# EAGLE design Wand LED Board Rev1 (EAGLE 9.7.0)
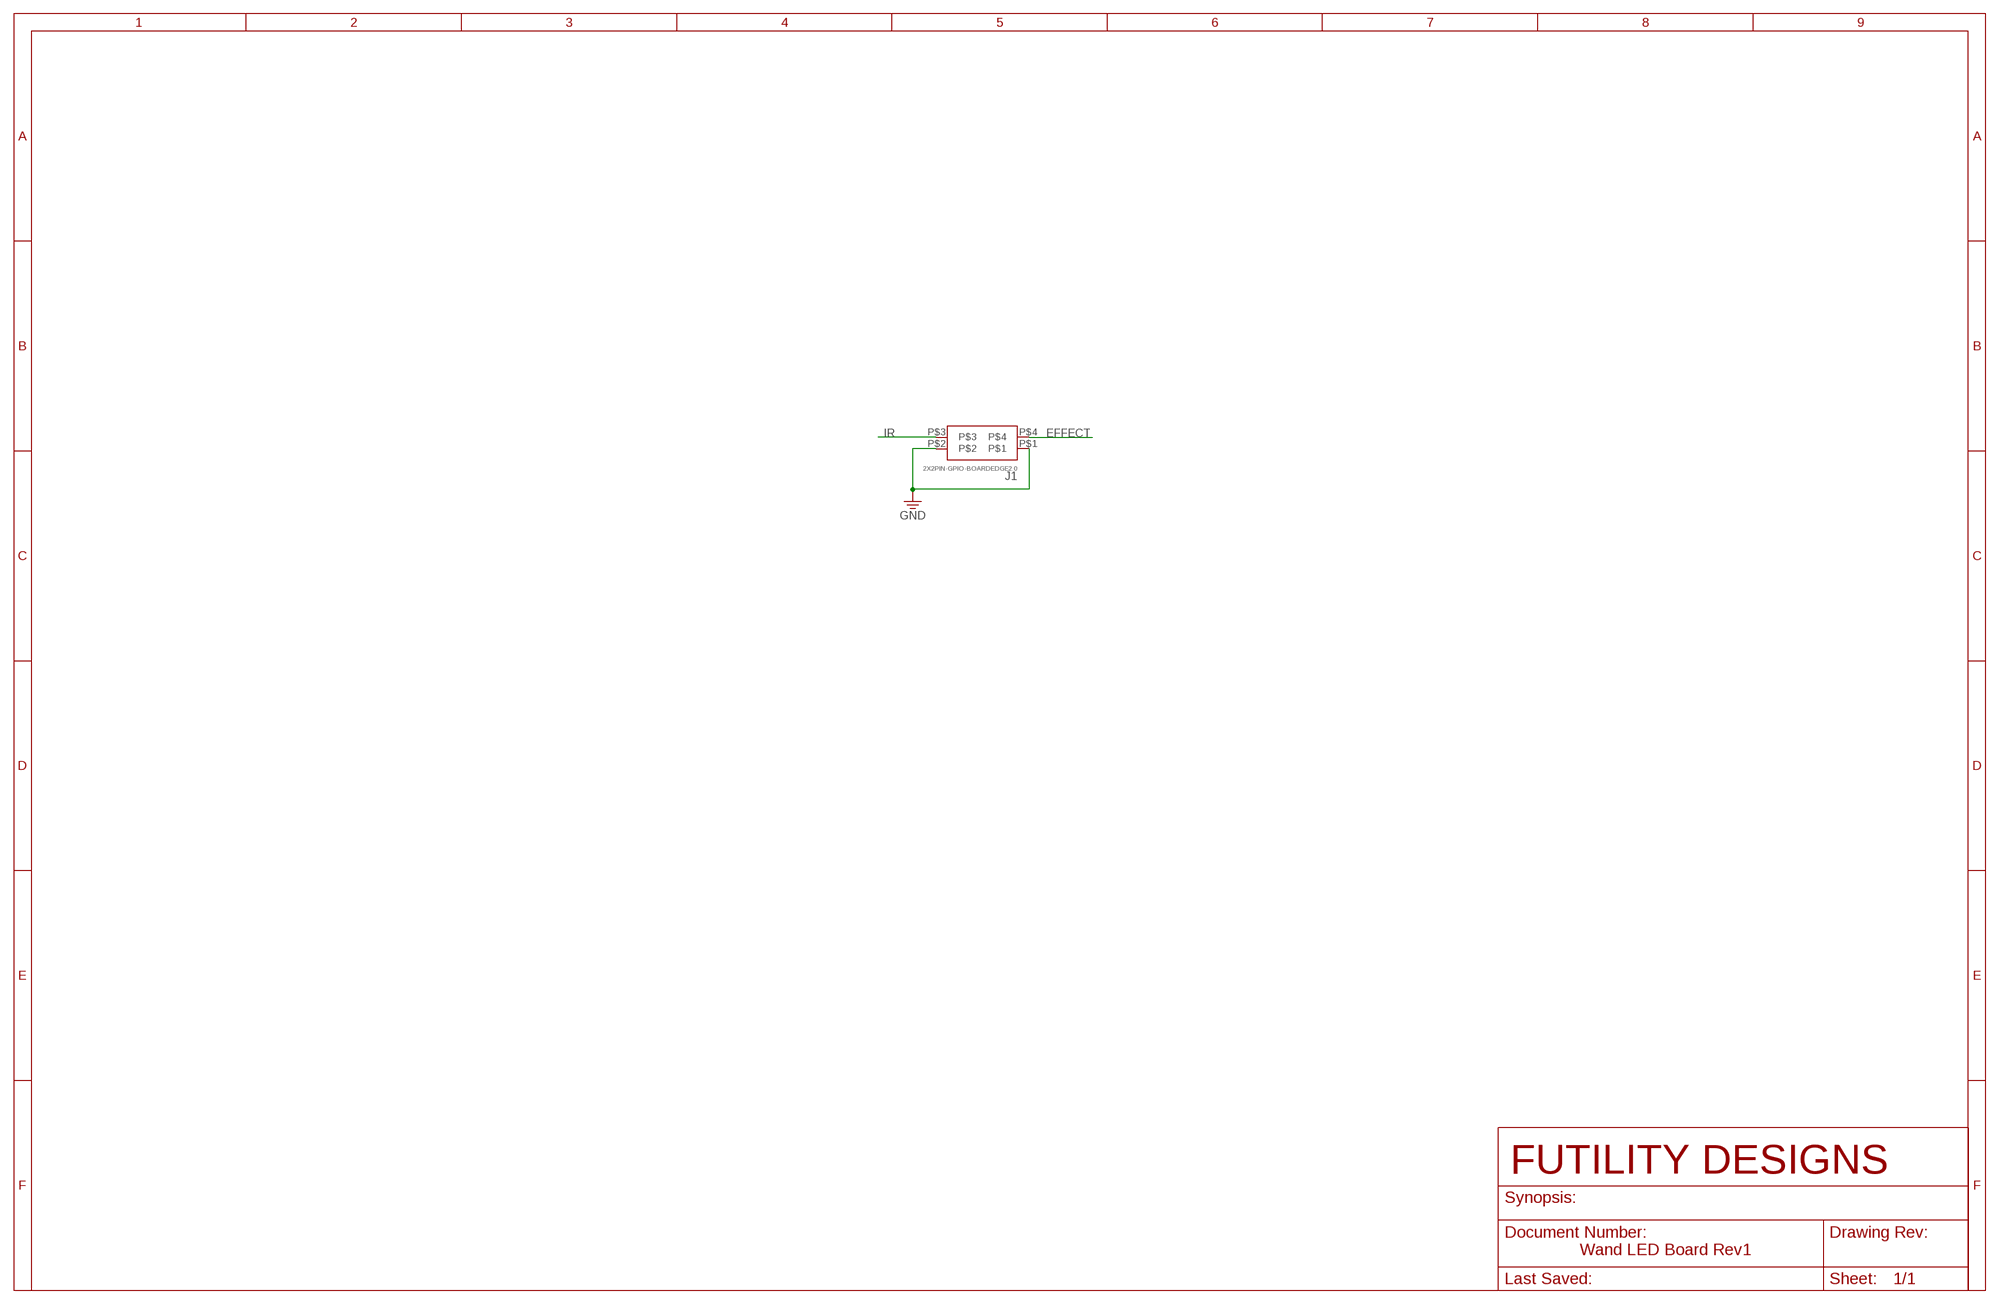
[diagram p0: schematic, sheet 1]

## Parts
J1  2X2PIN-GPIO-BOARDEDGE2.0  [2314820-4-BOARDEDGE]

## Nets
EFFECT: J1.P$4
GND: J1.P$1 J1.P$2
IR: J1.P$3

## Library data of the parts
J1 = 1-Chris-Connectors:2X2PIN-GPIO

## Board
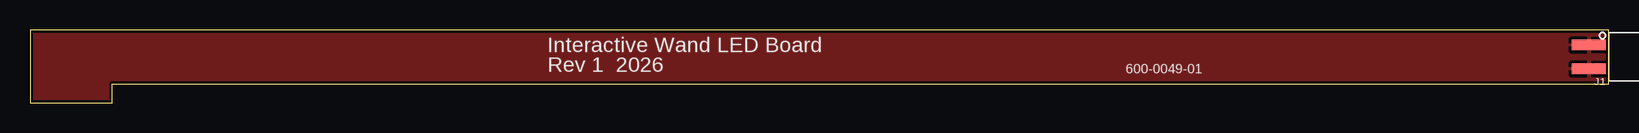
[diagram p1: board, top side]
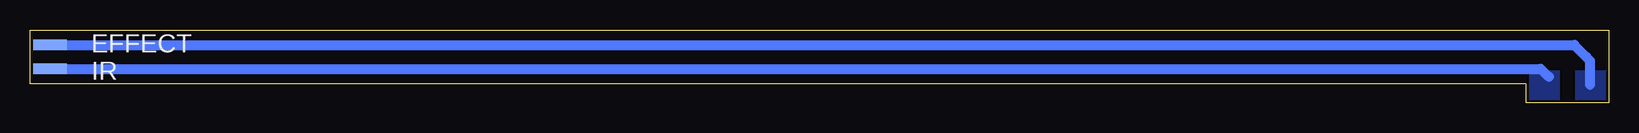
[diagram p2: board, bottom side, seen from below]

Size 131.55 x 6.12 mm. Coordinates in mm from the lower left corner, seen from the top.
Outline: 6.86,1.6 131.55,1.6 131.55,6.12 0,6.12 0,1.6 0,0 6.86,0 6.86,1.6
Copper layers (1*16): Top / Bottom
Stack-up Default Layer Stack: Top SilkScreen Epoxy Ink / Top SolderMask SR:Green 0.0254mm Dk 4.3 / Top Surface Finish Lead-Free 0.02mm / Top CuFoil:007 0.035mm / Dielectric-1 User Defined 1.5mm / Bottom CuFoil:007 0.035mm / Bottom Surface Finish Lead-Free 0.02mm / Bottom SolderMask SR:Green 0.0254mm Dk 4.3 / Bottom SilkScreen Epoxy Ink
Design rules: minimum copper width 6mil, minimum drill size 0.35mm, copper clearance wire_polygon to wire_polygon 6mil, copper clearance wire_polygon to pad_smd 6mil, copper clearance wire_polygon to via 6mil, copper clearance pad_smd to pad_smd 6mil, copper clearance pad_smd to via 6mil, copper clearance via to via 6mil, copper clearance smd to pad (same net) 6mil, copper clearance smd to via (same net) 6mil, copper clearance smd to smd (same net) 6mil, dimension clearance 10mil, via restrict clearance 0mil, restrict clearance 0mil, drill distance 6mil, keepout clearance 0mil

### Footprints (pad centres in the part's own frame; a part is rotated, then mirrored left to right if it is on the bottom)
2314820-4-BOARDEDGE = smd 2.794 x 0.889: P$1 1.651,-1; P$2 1.651,1 | smd 2.794 x 0.889 bottom: P$3 1.651,1; P$4 1.651,-1

### Placement (x,y rotation side)
J1  131.55,3.86 180 top

### Tracks (layer width: path | path; a pad name or v marks a point on that pad's centre or on a via)
EFFECT
  Bottom 0.813: J1.P$4 2.85,4.86 1.85,3.86 1.55,3.56 1.55,1.55
  pour Bottom: 0.25,0.25 2.79,0.25 2.79,2.74 0.25,2.74
GND
  pour Top: 0.25,0.25 6.6,0.25 6.6,2.74 0.25,2.74
  pour Top: -0.64,-0.41 137.21,-0.41 137.21,6.63 -0.64,6.63
IR
  Bottom 0.813: J1.P$3 5.66,2.86 4.98,2.18
  pour Bottom: 4.06,0.25 4.06,2.74 6.6,2.74 6.6,0.25

### Text on the board
SilkscreenTop: Interactive Wand LED Board | Rev 1 2026 | 600-0049-01
SilkscreenBottom: EFFECT / IR